# Altium schematic sheet Ultrasonic.SchDoc
size A2
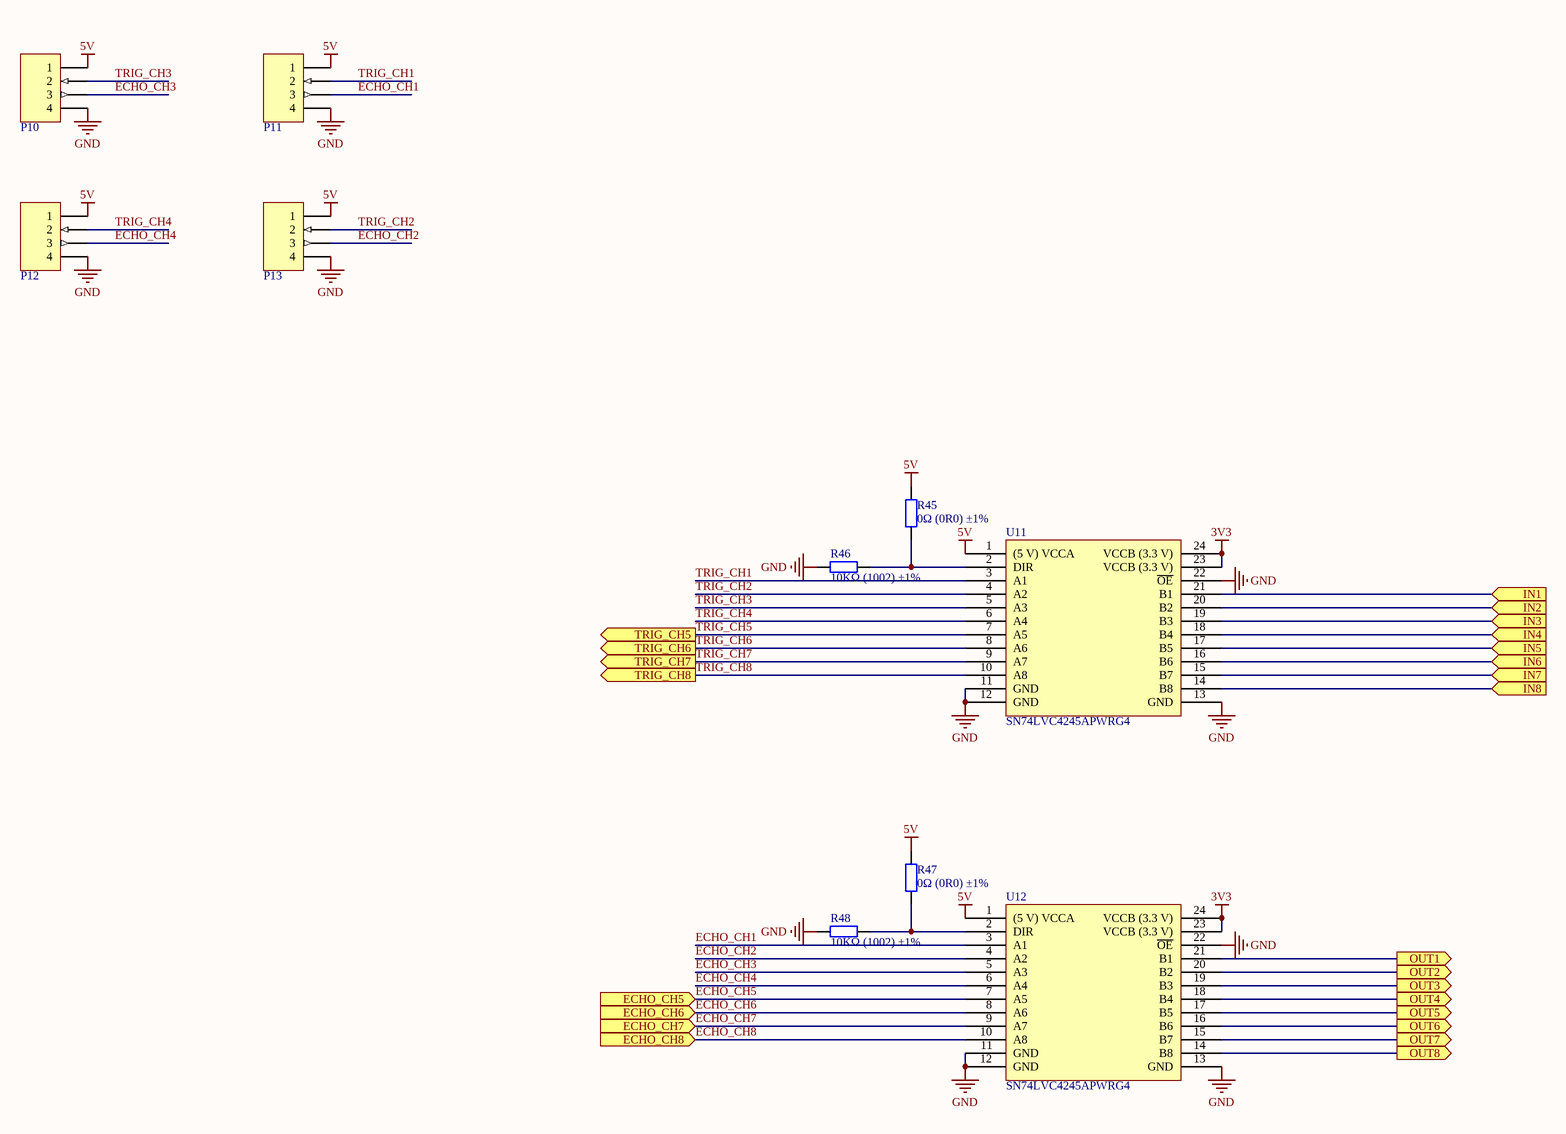
[diagram p0: Ultrasonic.SchDoc]

## Parts
P10  B4B-PH-SM4-TB(LF)(SN)  [B4B-PH-SM4-TB(LF)(SN)]  (value not drawn)
P11  B4B-PH-SM4-TB(LF)(SN)  [B4B-PH-SM4-TB(LF)(SN)]  (value not drawn)
P12  B4B-PH-SM4-TB(LF)(SN)  [B4B-PH-SM4-TB(LF)(SN)]  (value not drawn)
P13  B4B-PH-SM4-TB(LF)(SN)  [B4B-PH-SM4-TB(LF)(SN)]  (value not drawn)
R45  0Ω (0R0) ±1%  [0603_R]
R46  10KΩ (1002) ±1%  [0603_R]
R47  0Ω (0R0) ±1%  [0603_R]
R48  10KΩ (1002) ±1%  [0603_R]
U11  SN74LVC4245APWRG4  [TSSOP-24]
U12  SN74LVC4245APWRG4  [TSSOP-24]

## Ports
ECHO_CH5 (in), ECHO_CH6 (in), ECHO_CH7 (in), ECHO_CH8 (in), IN1 (in), IN2 (in), IN3 (in), IN4 (in), IN5 (in), IN6 (in), IN7 (in), IN8 (in), OUT1 (out), OUT2 (out), OUT3 (out), OUT4 (out), OUT5 (out), OUT6 (out), OUT7 (out), OUT8 (out), TRIG_CH5 (out), TRIG_CH6 (out), TRIG_CH7 (out), TRIG_CH8 (out)

## Nets
3V3: U11.23(VCCB_(3.3_V)) U11.24(VCCB_(3.3_V)) U12.23(VCCB_(3.3_V)) U12.24(VCCB_(3.3_V))
5V: P10.1 P11.1 P12.1 P13.1 R45.2 R47.2 U11.1((5_V)_VCCA) U12.1((5_V)_VCCA)
GND: P10.4 P11.4 P12.4 P13.4 R46.1 R48.1 U11.11(GND) U11.12(GND) U11.13(GND) U11.22(~{OE}) U12.11(GND) U12.12(GND) U12.13(GND) U12.22(~{OE})
ECHO_CH1: P11.3 U12.3(A1)
ECHO_CH2: P13.3 U12.4(A2)
ECHO_CH3: P10.3 U12.5(A3)
ECHO_CH4: P12.3 U12.6(A4)
ECHO_CH5: U12.7(A5) ; port ECHO_CH5
ECHO_CH6: U12.8(A6) ; port ECHO_CH6
ECHO_CH7: U12.9(A7) ; port ECHO_CH7
ECHO_CH8: U12.10(A8) ; port ECHO_CH8
IN1: U11.21(B1) ; port IN1
IN2: U11.20(B2) ; port IN2
IN3: U11.19(B3) ; port IN3
IN4: U11.18(B4) ; port IN4
IN5: U11.17(B5) ; port IN5
IN6: U11.16(B6) ; port IN6
IN7: U11.15(B7) ; port IN7
IN8: U11.14(B8) ; port IN8
OUT1: U12.21(B1) ; port OUT1
OUT2: U12.20(B2) ; port OUT2
OUT3: U12.19(B3) ; port OUT3
OUT4: U12.18(B4) ; port OUT4
OUT5: U12.17(B5) ; port OUT5
OUT6: U12.16(B6) ; port OUT6
OUT7: U12.15(B7) ; port OUT7
OUT8: U12.14(B8) ; port OUT8
TRIG_CH1: P11.2 U11.3(A1)
TRIG_CH2: P13.2 U11.4(A2)
TRIG_CH3: P10.2 U11.5(A3)
TRIG_CH4: P12.2 U11.6(A4)
TRIG_CH5: U11.7(A5) ; port TRIG_CH5
TRIG_CH6: U11.8(A6) ; port TRIG_CH6
TRIG_CH7: U11.9(A7) ; port TRIG_CH7
TRIG_CH8: U11.10(A8) ; port TRIG_CH8
NetR45_1: R45.1 R46.2 U11.2(DIR)
NetR47_1: R47.1 R48.2 U12.2(DIR)

## Library data of the parts
P10-P13 = CONN HEADER PH TOP 4POS 2MM SMD: Manufacturer: JST Sales America Inc.; Unit Price in Quantity: .3637; Part Number: CONN HEADER PH TOP 4POS 2MM SMD; Mounting Type: SMD; Package: header; Component Type: Standard; Pin Count: 4; Manufacturer Part Number: B4B-PH-SM4-TB(LF)(SN); Supplier 1: Digikey; Supplier 1 Part Number: 455-1736-1-ND; Unit Price-Supplier 1: .8; Price Break: 1000; Vendor/Distributor: Digikey
R45 R47 = 0603 0Ω (0R0) 1%: 贴片电阻; ComponentLink1Description: 供应商链接; ComponentLink1URL: http://www.szlcsc.com/product/details_21903.html; Package: 0603; Supplier: LC; SuppliersPartNumber: C21189
R46 R48 = 0603 10KΩ (1002) 1%: 贴片电阻; ComponentLink1Description: 供应商链接; ComponentLink1URL: http://www.szlcsc.com/product/details_26547.html; Package: 0603; Supplier: LC; SuppliersPartNumber: C25804
U11 U12 = SN74LVC4245APWRG4_[C7859]: 74系列逻辑芯片; ComponentLink1Description: 供应商链接; ComponentLink1URL: http://www.szlcsc.com/product/details_8336.html; Package: TSSOP-24; Supplier: LC; SuppliersPartNumber: C7859